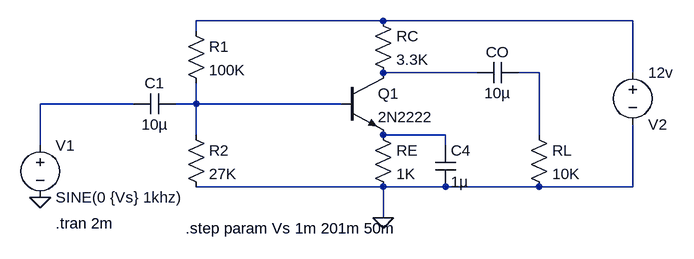
[diagram p0: schematic Circuito Emisor Común.asc]
Circuito Emisor Común.asc, the LTspice schematic file:
Version 4
SHEET 1 1028 680
WIRE 512 32 224 32
WIRE 896 32 512 32
WIRE 224 48 224 32
WIRE 656 112 512 112
WIRE 752 112 720 112
WIRE 896 112 896 32
WIRE 128 160 -16 160
WIRE 224 160 224 128
WIRE 224 160 192 160
WIRE 448 160 224 160
WIRE 224 208 224 160
WIRE 608 208 512 208
WIRE 752 208 752 112
WIRE -16 224 -16 160
WIRE 608 224 608 208
WIRE 512 288 224 288
WIRE 608 288 512 288
WIRE 752 288 608 288
WIRE 896 288 896 192
WIRE 896 288 752 288
WIRE 512 336 512 288
FLAG -16 304 0
FLAG 512 336 0
SYMBOL voltage -16 208 R0
WINDOW 123 0 0 Left 0
WINDOW 39 0 0 Left 0
SYMATTR InstName V1
SYMATTR Value SINE(0 {Vs} 1khz)
SYMBOL voltage 896 96 R0
WINDOW 0 24 96 Left 2
WINDOW 3 24 16 Left 2
WINDOW 123 0 0 Left 0
WINDOW 39 0 0 Left 0
SYMATTR InstName V2
SYMATTR Value 12v
SYMBOL res 208 32 R0
SYMATTR InstName R1
SYMATTR Value 100K
SYMBOL res 208 192 R0
SYMATTR InstName R2
SYMATTR Value 27K
SYMBOL cap 192 144 R90
WINDOW 0 0 32 VBottom 2
WINDOW 3 32 32 VTop 2
SYMATTR InstName C1
SYMATTR Value 10µ
SYMBOL npn 448 112 R0
SYMATTR InstName Q1
SYMATTR Value 2N2222
SYMBOL res 496 16 R0
SYMATTR InstName RC
SYMATTR Value 3.3K
SYMBOL res 496 192 R0
SYMATTR InstName RE
SYMATTR Value 1K
SYMBOL res 736 192 R0
SYMATTR InstName RL
SYMATTR Value 10K
SYMBOL cap 720 96 R90
WINDOW 0 0 32 VBottom 2
WINDOW 3 32 32 VTop 2
SYMATTR InstName CO
SYMATTR Value 10µ
SYMBOL cap 592 224 R0
SYMATTR InstName C4
SYMATTR Value 1µ
TEXT 8 344 Left 2 !.tran 2m
TEXT 208 352 Left 2 !.step param Vs 1m 201m 50m

The netlist it stands for:
* Circuito Emisor Común.asc
V1 N004 0 SINE(0 {Vs} 1khz)
V2 N001 0 12v
R1 N001 N005 100K
R2 N005 0 27K
C1 N005 N004 10µ
Q1 N002 N005 N006 0 2N2222
RC N001 N002 3.3K
RE N006 0 1K
RL N003 0 10K
CO N003 N002 10µ
C4 N006 0 1µ
.model NPN NPN
.model PNP PNP
.lib standard.bjt
.tran 2m
.step param Vs 1m 201m 50m
.backanno
.end